# Altium schematic sheet [03] - DAC.SchDoc
size A4; DocumentNumber: 3; SheetNumber: 3; SheetTotal: 5
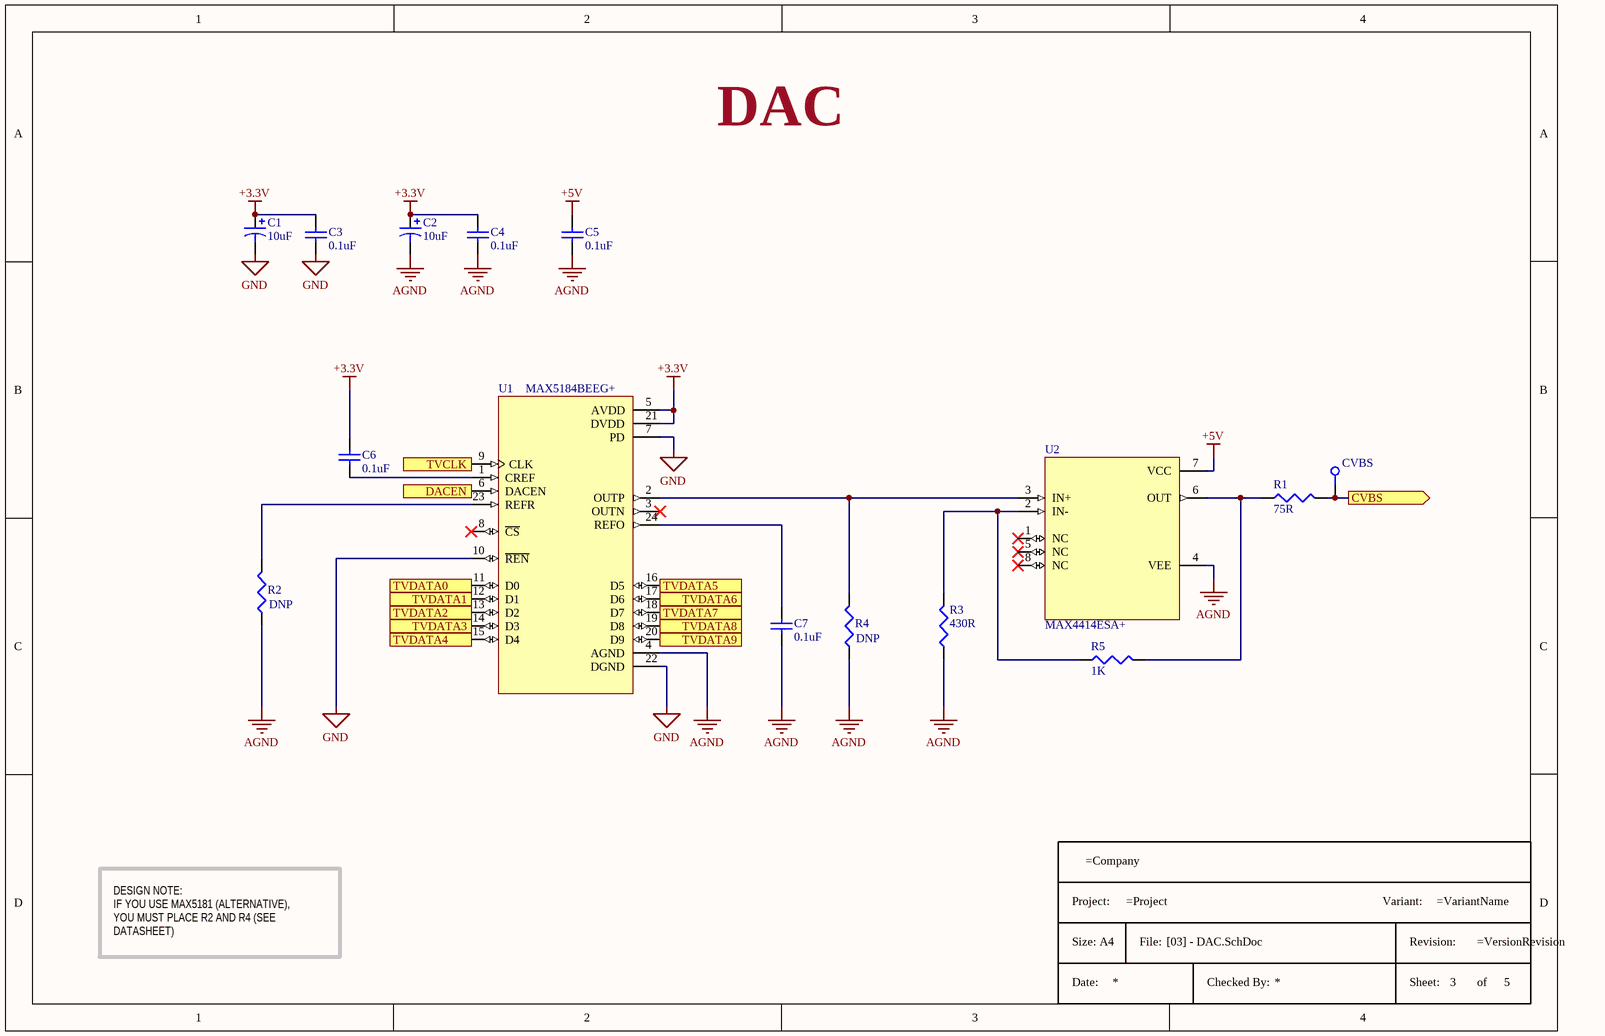
[diagram p0: [03] - DAC.SchDoc]

## Parts
*  Title Block A4  (value not drawn)  (graphical)
C1  10uF  [C1206T]
C2  10uF  [C1206T]
C3  0.1uF  [C1206]
C4  0.1uF  [C1206]
C5  0.1uF  [C1206]
C6  0.1uF  [C1206]
C7  0.1uF  [C1206]
CVBS  TP_25MILC  [TP_25C]  (value not drawn)  (no BOM)
R1  75R  [R0603]
R2  DNP  [R0603]
R3  430R  [R0603]
R4  DNP  [R0603]
R5  1K  [R0603]
U1  MAX5184BEEG+  [SOP63P602X175-24N]
U2  MAX4414ESA+  [SOIC127P600X175-8N]

## Ports
CVBS (out), DACEN (in), TVCLK (in), TVDATA0 (in), TVDATA1 (in), TVDATA2 (in), TVDATA3 (in), TVDATA4 (in), TVDATA5 (in), TVDATA6 (in), TVDATA7 (in), TVDATA8 (in), TVDATA9 (in)

## Nets
+3.3V: C1.1 C2.1 C3.2 C4.2 C6.1 U1.5(AVDD) U1.21(DVDD)
+5V: C5.2 U2.7(VCC)
AGND: C2.2 C4.1 C5.1 C7.1 R2.1 R3.1 R4.1 U1.4(AGND) U2.4(VEE)
GND: C1.2 C3.1 U1.7(PD) U1.10(~{REN}) U1.22(DGND)
CVBS: CVBS.1 R1.2 ; port CVBS
DACEN: U1.6(DACEN) ; port DACEN
TVCLK: U1.9(CLK) ; port TVCLK
TVDATA0: U1.11(D0) ; port TVDATA0
TVDATA1: U1.12(D1) ; port TVDATA1
TVDATA2: U1.13(D2) ; port TVDATA2
TVDATA3: U1.14(D3) ; port TVDATA3
TVDATA4: U1.15(D4) ; port TVDATA4
TVDATA5: U1.16(D5) ; port TVDATA5
TVDATA6: U1.17(D6) ; port TVDATA6
TVDATA7: U1.18(D7) ; port TVDATA7
TVDATA8: U1.19(D8) ; port TVDATA8
TVDATA9: U1.20(D9) ; port TVDATA9
NetC6_2: C6.2 U1.1(CREF)
NetC7_2: C7.2 U1.24(REFO)
NetR1_1: R1.1 R5.2 U2.6(OUT)
NetR2_2: R2.2 U1.23(REFR)
NetR3_2: R3.2 R5.1 U2.2(IN-)
NetR4_2: R4.2 U1.2(OUTP) U2.3(IN+)

Not connected (* = marked no-connect by the designer): U1 3(OUTN)* 8(~{CS})*; U2 1(NC)* 5(NC)* 8(NC)*

## Notes on the sheet
- DAC
- DESIGN NOTE:
  IF YOU USE MAX5181 (ALTERNATIVE), YOU MUST PLACE R2 AND R4 (SEE DATASHEET)
- (in symbol Title Block A4) Project:; Variant:; Size: A4; File:; Revision:; Date:; Checked By:; Sheet:; of

## Library data of the parts
C1 C2 = T491A106K010AT: CAPACITOR, CASE A, 10UF, 10V; Product Range:KEMET - T491 Series; Capacitance:10µF; Capacitance Tolerance:± 10%; Voltage Rating:10V; Capacitor Case Style:1206 [3216 Metric]; Manufacturer Size Code:A; Operating Temperature Max:125°C; ;RoHS Compliant: Yes; Manufacturer: KEMET; Dielectric Material: Tantalum; ESR (Equivalent Series Resistance): 4R; Life (Hours): 2000Hour; Polarity: Polar; Dissipation Factor: 6%; Leakage Current: 1uA; Ripple Current: 137mA; Supplier 1: Mouser; Manufacturer Part Number: T491A106K010AT; RoHS: Yes; Category: Tantalum Capacitors; Pricing 1: 1=0,33000, 10=0,16200, 50=0,16200, 100=0,13900, 1000=0,08800, 10000=0,06100 (USD); Mount: Surface Mount,PCB; Case/Package: 1206; Case Code (Metric): 3216; Case Code (Imperial): 1206; Min Operating Temperature: -55°C; Max Operating Temperature: 125°C; Capacitance: 10uF; Tolerance: 10%; Packaging: Tape and Reel; Voltage Rating: 10V; Features: General Purpose; Package Quantity: 2000; Termination: SMD/SMT; Voltage Rating (DC): 10V; Voltage: 10V; Length: 3.2mm; Width: 0.063inch; Height: 1.6mm; Depth: 1.6mm; Height - Seated (Max): 0.071inch; Lead Free: Lead Free; REACH SVHC: No SVHC; ComponentLink1URL: https://datasheet.ciiva.com/257/kem-t2005-t491-257584.pdf?src-supplier=Digi-Key; ComponentLink1Description: https://datasheet.ciiva.com/257/kem-t2005-t491-257584.pdf?src-supplier=Digi-Key; ComponentLink2URL: https://datasheet.ciiva.com/11793/0900766b80718482-11793106.pdf?src-supplier=RSComponents; ComponentLink2Description: https://datasheet.ciiva.com/11793/0900766b80718482-11793106.pdf?src-supplier=RSComponents; ComponentLink3URL: https://datasheet.ciiva.com/7668/1732743-7668006.pdf?src-supplier=Element14; ComponentLink3Description: https://datasheet.ciiva.com/7668/1732743-7668006.pdf?src-supplier=Element14; ComponentLink4URL: https://datasheet.ciiva.com/20171/458293-da-en-01-20171903.pdf?src-supplier=Rapid+Electronics; ComponentLink4Description: https://datasheet.ciiva.com/20171/458293-da-en-01-20171903.pdf?src-supplier=Rapid+Electronics; ComponentLink5URL: https://datasheet.ciiva.com/27052/1573249-27052559.pdf?src-supplier=Jameco; ComponentLink5Description: https://datasheet.ciiva.com/27052/1573249-27052559.pdf?src-supplier=Jameco; ComponentLink6URL: https://datasheet.ciiva.com/257/kem-t2005-t491-257585.pdf?src-supplier=Digi-Key; ComponentLink6Description: https://datasheet.ciiva.com/257/kem-t2005-t491-257585.pdf?src-supplier=Digi-Key; ComponentLink7URL: https://datasheet.ciiva.com/257/kem-t2005-t491-257586.pdf?src-supplier=Digi-Key; ComponentLink7Description: https://datasheet.ciiva.com/257/kem-t2005-t491-257586.pdf?src-supplier=Digi-Key; ComponentLink8URL: https://datasheet.ciiva.com/7668/1854511-7668005.pdf?src-supplier=Element14; ComponentLink8Description: https://datasheet.ciiva.com/7668/1854511-7668005.pdf?src-supplier=Element14; ComponentLink9URL: https://datasheet.ciiva.com/7668/1854511-7668007.pdf?src-supplier=Element14; ComponentLink9Description: https://datasheet.ciiva.com/7668/1854511-7668007.pdf?src-supplier=Element14; ComponentLink10URL: https://datasheet.ciiva.com/7668/1446014-7668008.pdf?src-supplier=Element14; ComponentLink10Description: https://datasheet.ciiva.com/7668/1446014-7668008.pdf?src-supplier=Element14; ComponentLink11URL: https://datasheet.ciiva.com/12882/kem-t2005-t491-12882826.pdf?src-supplier=Mouser; ComponentLink11Description: https://datasheet.ciiva.com/12882/kem-t2005-t491-12882826.pdf?src-supplier=Mouser; ComponentLink12URL: https://datasheet.ciiva.com/7668/kem-t2005-t491-7668139.pdf?src-supplier=Element14; ComponentLink12Description: https://datasheet.ciiva.com/7668/kem-t2005-t491-7668139.pdf?src-supplier=Element14; ComponentLink13URL: https://datasheet.ciiva.com/14586/70095774-14586699.pdf?src-supplier=Allied+Electronics; ComponentLink13Description: https://datasheet.ciiva.com/14586/70095774-14586699.pdf?src-supplier=Allied+Electronics; ComponentLink14URL: https://datasheet.ciiva.com/14596/70095774-14596972.pdf?src-supplier=Allied+Electronics; ComponentLink14Description: https://datasheet.ciiva.com/14596/70095774-14596972.pdf?src-supplier=Allied+Electronics; ComponentLink15URL: https://datasheet.ciiva.com/29244/458293-da-01-en-kondensator-10uf-3216-10pr-10v-85c-29244583.pdf?src-supplier=Conrad; ComponentLink15Description: https://datasheet.ciiva.com/29244/458293-da-01-en-kondensator-10uf-3216-10pr-10v-85c-29244583.pdf?src-supplier=Conrad; Supplier Part Number 1: 80-T491A106K010
C3-C7 = GRM319R71H104KA01D: MURATA - GRM319R71H104KA01D - COND, CERÁ MULT, X7R, 100NF, 50V, 1206; Supplier 1: Farnell; Manufacturer: MURATA; Manufacturer Part Number: GRM319R71H104KA01D; RoHS: YES; Stock 1: 24194; Pricing 1: 10=0,0548, 100=0,0373, 500=0,0298, 1000=0,0271, 2000=0,0248, 4000=0,0231, 20000=0,0213, 40000=0,0209 (EUR); ComponentLink1URL: http://www.farnell.com/datasheets/2048709.pdf; ComponentLink1Description: http://www.farnell.com/datasheets/2048709.pdf; ComponentLink2URL: http://www.farnell.com/datasheets/2006461.pdf; ComponentLink2Description: http://www.farnell.com/datasheets/2006461.pdf; Supplier 2: Digi-Key; Supplier Part Number 1: 1828956; Supplier Part Number 2: 490-1775-1-ND
CVBS = TP_25MILC: Test Point 25mil
R1 = CRCW060375R0FKEA: VISHAY - CRCW060375R0FKEA - RES, 75R, 1%, 0.1W, 0603, THICK FILM; Power Rating: 100mW; Temperature Coefficient: 100ppm/°C; Voltage Rating: 75V; Supplier 1: Mouser; Manufacturer: Vishay; Manufacturer Part Number: CRCW060375R0FKEA; RoHS: Yes; Category: Chip SMD Resistors; Stock 1: 107137; Pricing 1: 1=0,10000, 10=0,03100, 50=0,03100, 100=0,01300, 1000=0,00500, 10000=0,00500 (USD); Case/Package: 0603; Contact Plating: Tin; Weight: 7.1E-05oz; Case Code (Imperial): 0603; Case Code (Metric): 1608; Min Operating Temperature: -55°C; Max Operating Temperature: 155°C; Resistance: 75R; Tolerance: 1%; Resistor Type: Thick Film; Packaging: Tape and Reel; Package Quantity: 5000; Termination: SMD/SMT; Number of Terminations: 2; Voltage Rating (DC): 75V; Working Voltage: 75V; Length: 1.55mm; Width: 0.85mm; Height: 0.45mm; Depth: 0.85mm; Lead Free: Lead Free; REACH SVHC: Unknown; Military Standard: Not; ComponentLink1URL: https://datasheet.ciiva.com/11809/0900766b80d98afc-11809100.pdf?src-supplier=RSComponents; ComponentLink1Description: https://datasheet.ciiva.com/11809/0900766b80d98afc-11809100.pdf?src-supplier=RSComponents; ComponentLink2URL: https://datasheet.ciiva.com/16199/dcrcwe3-16199141.pdf?src-supplier=Future+Electronics; ComponentLink2Description: https://datasheet.ciiva.com/16199/dcrcwe3-16199141.pdf?src-supplier=Future+Electronics; ComponentLink3URL: https://datasheet.ciiva.com/5541/dcrcwe3-109170-5541910.pdf?src-supplier=Mouser; ComponentLink3Description: https://datasheet.ciiva.com/5541/dcrcwe3-109170-5541910.pdf?src-supplier=Mouser; ComponentLink4URL: https://datasheet.ciiva.com/16722/70201119-16722522.pdf?src-supplier=Allied+Electronics; ComponentLink4Description: https://datasheet.ciiva.com/16722/70201119-16722522.pdf?src-supplier=Allied+Electronics; ComponentLink5URL: https://datasheet.ciiva.com/7673/1697337-7673323.pdf?src-supplier=Element14; ComponentLink5Description: https://datasheet.ciiva.com/7673/1697337-7673323.pdf?src-supplier=Element14; ComponentLink6URL: https://datasheet.ciiva.com/16852/dcrcwe3-16852747.pdf?src-supplier=Avnet+Europe; ComponentLink6Description: https://datasheet.ciiva.com/16852/dcrcwe3-16852747.pdf?src-supplier=Avnet+Europe; ComponentLink7URL: https://datasheet.ciiva.com/3257/dcrcwe3-3257884.pdf?src-supplier=Avnet; ComponentLink7Description: https://datasheet.ciiva.com/3257/dcrcwe3-3257884.pdf?src-supplier=Avnet; ComponentLink8URL: https://datasheet.ciiva.com/3257/dcrcwe3-3257885.pdf?src-supplier=Avnet; ComponentLink8Description: https://datasheet.ciiva.com/3257/dcrcwe3-3257885.pdf?src-supplier=Avnet; ComponentLink9URL: https://datasheet.ciiva.com/16780/70201119-16780254.pdf?src-supplier=Allied+Electronics; ComponentLink9Description: https://datasheet.ciiva.com/16780/70201119-16780254.pdf?src-supplier=Allied+Electronics; ComponentLink10URL: https://datasheet.ciiva.com/7673/1697337-7673471.pdf?src-supplier=Element14; ComponentLink10Description: https://datasheet.ciiva.com/7673/1697337-7673471.pdf?src-supplier=Element14; Supplier Part Number 1: 71-CRCW0603-75-E3
R2 R4 = R0603
R3 = MCWF06R4300BTL: Res, 430R, 0.1%, 0.1W, 0603, Thin Film; Manufacturer: Multicomp; Voltage Rating (DC): 75V; Temperature Coefficient: 25ppm/°C; Power Rating: 100mW; Supplier 1: Farnell; Manufacturer Part Number: MCWF06R4300BTL; RoHS: No; Stock 1: 14065; Pricing 1: 10=0,10600, 100=0,06130, 500=0,04660, 1000=0,04090, 2500=0,03490, 5000=0,02950, 25000=0,02460, 50000=0,02090 (EUR); Case Code (Imperial): 0603; Case Code (Metric): 1608; Tolerance: 0.1%; Resistance: 430R; Voltage Rating: 75V; Packaging: Cut Tape; Resistor Type: Thin Film; REACH SVHC: No SVHC; ComponentLink1URL: http://www.farnell.com/datasheets/1729042.pdf?src-supplier=Element14; ComponentLink1Description: http://www.farnell.com/datasheets/1729042.pdf?src-supplier=Element14; ComponentLink2URL: http://www.farnell.com/datasheets/1729040.pdf?src-supplier=Element14; ComponentLink2Description: http://www.farnell.com/datasheets/1729040.pdf?src-supplier=Element14; Supplier Part Number 1: 2337178
R5 = ESR03EZPF1001: ROHM - ESR03EZPF1001 - SMD Chip Resistor, Anti-Surge, 0603 [1608 Metric], 1 kohm, ESR Series, 150 V, Thick Film, 250 mW; Temperature Coefficient: 100ppm/°C; Max Power Dissipation: 250mW; Resistance: 1kR; Tolerance: 1%; Supplier 1: Mouser; Manufacturer: Rohm; Manufacturer Part Number: ESR03EZPF1001; RoHS: Yes; Category: Chip SMD Resistors; Stock 1: 87852; Pricing 1: 1=0,13000, 10=0,11100, 50=0,11100, 100=0,04400, 1000=0,01700, 10000=0,01100 (USD); Case/Package: 0603; Case Code (Metric): 1608; Case Code (Imperial): 0603; Min Operating Temperature: -55°C; Max Operating Temperature: 155°C; Resistor Type: Thick Film; Number of Terminations: 2; Features: Automotive AEC-Q200; Package Quantity: 1; Power Rating: 250mW; Packaging: Tape and Reel; Length: 0.063inch; Width: 0.031inch; Height: 0.022inch; Lead Free: Lead Free; ComponentLink1URL: https://datasheet.ciiva.com/2469/esr-2469712.pdf?src-supplier=Digi-Key; ComponentLink1Description: https://datasheet.ciiva.com/2469/esr-2469712.pdf?src-supplier=Digi-Key; ComponentLink2URL: https://datasheet.ciiva.com/2469/esr-2469713.pdf?src-supplier=Digi-Key; ComponentLink2Description: https://datasheet.ciiva.com/2469/esr-2469713.pdf?src-supplier=Digi-Key; ComponentLink3URL: https://datasheet.ciiva.com/2469/esr-2469714.pdf?src-supplier=Digi-Key; ComponentLink3Description: https://datasheet.ciiva.com/2469/esr-2469714.pdf?src-supplier=Digi-Key; Supplier Part Number 1: 755-ESR03EZPF1001
U1 = MAX5184BEEG+: DAC 1-CH Current Steering 10-bit 24-Pin QSOP; Manufacturer: Maxim; Integral Nonlinearity (INL): 2LSB; Full Scale Error: 40LSB; Resolution: 10b; Output Type: Voltage; Interface: Parallel; Supply Type: Analog,Digital; Number of Converters: 1; Settling Time: 25us; Number of Bits: 10; Max Supply Voltage: 3.3V; Min Supply Voltage: 2.7V; Supplier 1: Farnell; Manufacturer Part Number: MAX5184BEEG+; RoHS: Yes; Category: Digital to Analog Converters (DACs); Stock 1: 67; Pricing 1: 1=4,14000, 10=3,73000, 25=3,57000, 50=3,46000, 100=3,38000, 250=3,31000, 500=3,23000 (EUR); Mount: Surface Mount; Case/Package: QSOP; Number of Pins: 24; Min Operating Temperature: -40°C; Max Operating Temperature: 85°C; Packaging: Rail/Tube; Package Quantity: 50; Number of DAC Channels: 1; Radiation Hardening: No; REACH SVHC: No SVHC; ComponentLink1URL: https://datasheet.ciiva.com/7657/37859-7657051.pdf?src-supplier=Element14; ComponentLink1Description: https://datasheet.ciiva.com/7657/37859-7657051.pdf?src-supplier=Element14; ComponentLink2URL: https://datasheet.ciiva.com/26802/max5184beeg-26802205.pdf?src-supplier=IIIC; ComponentLink2Description: https://datasheet.ciiva.com/26802/max5184beeg-26802205.pdf?src-supplier=IIIC; ComponentLink3URL: https://datasheet.ciiva.com/1369/max5181-max5184-1369083.pdf?src-supplier=Digi-Key; ComponentLink3Description: https://datasheet.ciiva.com/1369/max5181-max5184-1369083.pdf?src-supplier=Digi-Key; ComponentLink4URL: https://datasheet.ciiva.com/14250/max5181-max5184-14250750.pdf?src-supplier=Avnet; ComponentLink4Description: https://datasheet.ciiva.com/14250/max5181-max5184-14250750.pdf?src-supplier=Avnet; Supplier Part Number 1: 2514736
U2 = MAX4414ESA+: IC OPAMP VFB 400MHZ RRO 8SOIC; Manufacturer: Maxim; Min Supply Voltage: 2.7V; Max Supply Voltage: 5.5V; Voltage Gain: 80dB; Common Mode Rejection Ratio: 65dB; Slew Rate: 200V/µs; Input Offset Voltage (Vos): 500uV; Operating Supply Current: 1.6mA; Number of Channels: 1; Output Current per Channel: 75mA; Input Bias Current: 1.3uA; Max Power Dissipation: 471mW; Power Supply Rejection Ratio (PSRR): 77dB; Supplier 1: Avnet; Manufacturer Part Number: MAX4414ESA+; RoHS: Yes; Category: Amplifiers - Op Amps, Buffer, Instrumentation; Stock 1: 26813; Pricing 1: 200=2,46210, 400=2,42730, 600=2,39250, 1000=2,35770, 2000=2,32290, 10000=2,28810, 20000=2,25330 (USD); Mount: Surface Mount; Case/Package: SOIC; Number of Pins: 8; Min Operating Temperature: -40°C; Max Operating Temperature: 85°C; Packaging: Rail/Tube; -3db Bandwidth: 400MHz; Gain Bandwidth Product: 400MHz; Number of Circuits: 1; Series: MAX4414; Package Quantity: 100; Nominal Supply Current: 1.6mA; Output Current: 75mA; Bandwidth: 400MHz; Number of Amplifiers: 1; Supply Current: 1.6mA; Radiation Hardening: No; RoHS Compliant: Yes; REACH SVHC: Unknown; ComponentLink1URL: https://datasheet.ciiva.com/1819/max4414-max4419-1819941.pdf?src-supplier=Digi-Key; ComponentLink1Description: https://datasheet.ciiva.com/1819/max4414-max4419-1819941.pdf?src-supplier=Digi-Key; Supplier Part Number 1: MAX4414ESA+